# EAGLE design shaltregler (EAGLE 4.16)
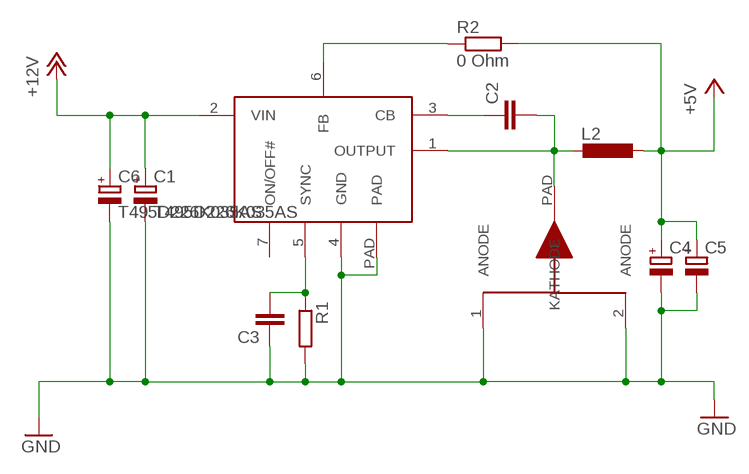
[diagram p0: schematic, sheet 1]

## Parts
C1  T495D226K035AS  CPOL-EUD/7343-31R  [D/7343-31R]
C2  C-EUC1206K  [C1206K]
C3  C-EUC1206K  [C1206K]
C4  CPOL-EUD/7343-31R  [D/7343-31R]
C5  CPOL-EUD/7343-31R  [D/7343-31R]
C6  T495D226K035AS  CPOL-EUD/7343-31R  [D/7343-31R]
D1  DIODE50WQ03FN  [TO-252]
IC1  LM2677S  [TO-263]
L2  DO3316P  [DO3316P]
R1  R-EU_R1206  [R1206]
R2  0 Ohm  R-EU_R1206  [R1206]

## Nets
+5V: C4.+ C5.+ L2.2 R2.2
+12V: C1.+ C6.+ IC1.2(VIN)
GND: C1.- C3.1 C4.- C5.- C6.- D1.1(ANODE) D1.2(ANODE) IC1.4(GND) IC1.PAD R1.2
N$1: IC1.6(FB) R2.1
N$2: C3.2 IC1.5(SYNC) R1.1
N$3: C2.2 D1.PAD(KATHODE) IC1.1(OUTPUT) L2.1
N$4: C2.1 IC1.3(CB)
Unconnected: IC1.7(ON/OFF#)

## Library data of the parts
C1 C4-C6 = rcl:CPOL-EU: POLARIZED CAPACITOR, European symbol
C2 C3 = rcl:C-EU: CAPACITOR, European symbol
D1 = Kochtec:DIODE
IC1 = Kochtec:LM2677: LM2677 National Semiconductor Simple Switcher High Efficiency 5A Step-Down Voltage Regulator with Sync
L2 = inductor-coilcraft:DO3316P: COILCRAFT
R1 R2 = rcl:R-EU_: RESISTOR, European symbol

## Board
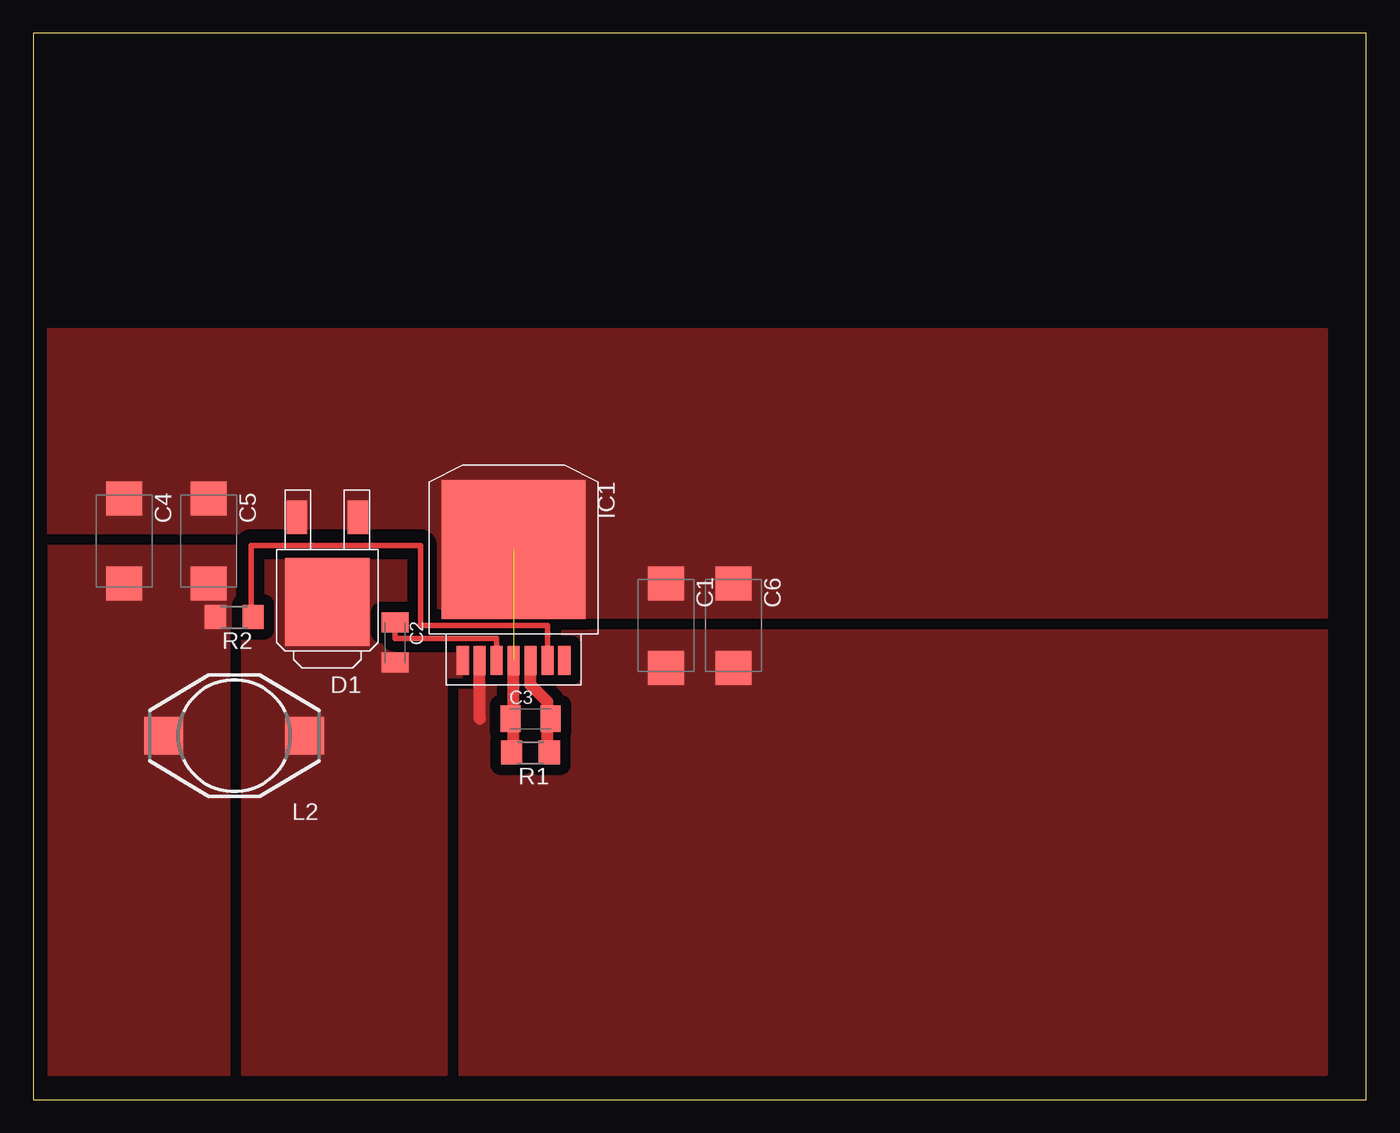
[diagram p1: board, top side]

Size 100 x 80 mm. Coordinates in mm from the lower left corner, seen from the top.
Outline: 0,0 100,0 100,80 0,80 0,0
Copper layers (1*16): Top 0.035mm / dielectric 1.5mm / Bottom 0.035mm
Design rules "default": minimum track width 10mil, minimum drill 24mil, track to track 8mil, track to pad 8mil, pad to pad 8mil, via to via 8mil, smd to smd 8mil, copper to edge 40mil, drill to drill 8mil, minimum pad ring 10mil, minimum via ring 8mil, stop-mask expansion 4mil, vias tented up to drill 0mil, thermal gap 10mil

### Footprints (pad centres in the part's own frame; a part is rotated, then mirrored left to right if it is on the bottom)
D/7343-31R = smd 2.55 x 2.7: + 3.175,0; - -3.175,0
C1206K = smd 1.5 x 2: 1 -1.5,0; 2 1.5,0
TO-252 = smd 1.524 x 2.54: 1 -2.286,-9.398; 2 2.286,-9.398 | smd 6.35 x 6.604: PAD 0,-3.048
TO-263 = smd 2.159 x 0.914: 1 8.331,-3.81; 2 8.331,-2.54; 3 8.331,-1.27; 4 8.331,0; 5 8.331,1.27; 6 8.331,2.54; 7 8.331,3.81 | smd 10.414 x 10.795: PAD 0,0
DO3316P = smd 2.92 x 2.79: 1 -5.28,0; 2 5.28,0
R1206 = smd 1.6 x 1.803: 1 -1.422,0; 2 1.422,0

### Placement (x,y rotation side)
C1  47.46,35.55 270 top
C2  27.14,34.29 270 top
C3  37.3,28.57 0 top
C4  6.82,41.91 270 top
C5  13.17,41.91 270 top
C6  52.54,35.55 270 top
D1  22.06,34.29 180 top
IC1  36.03,41.27 270 top
L2  15.08,27.3 180 top
R1  37.3,26.03 180 top
R2  15.08,36.19 180 top

### Tracks (layer width: path | path; a pad name or v marks a point on that pad's centre or on a via)
+5V
  pour Top (isolate 0.813, rank 3, no thermals): 1.1,41.91 1.1,1.9 15.08,1.9 15.08,41.91
+12V
  Top 0.889: 33.49,28.57 IC1.2
  pour Top (isolate 0.813, rank 3, no thermals): 96.99,35.55 96.99,1.9 30.95,1.9 30.95,35.55
GND  (1 unrouted)
  Top 0.889: 36.03,28.57 36.03,26.03 R1.2 | 36.03,28.57 IC1.4 | 36.03,28.57 C3.1
  pour Top (isolate 1.016, no thermals): 0.47,42.54 25.87,42.54 25.87,36.19 96.99,36.19 96.99,57.78 0.47,57.78
N$1
  Top 0.406: IC1.6 38.57,35.55 29.04,35.55 29.04,41.59 16.34,41.59 16.34,36.19 R2.1
N$2
  Top 0.889: IC1.5 37.3,31.11 38.57,29.84 38.57,28.57 | 38.57,28.57 38.57,26.03 R1.1 | 38.57,28.57 C3.2
N$3
  pour Top (isolate 0.813, rank 2, no thermals): 30.95,31.74 32.85,31.74 32.85,41.91 15.71,41.91 15.71,1.9 30.95,1.9
N$4
  Top 0.406: IC1.3 34.76,34.6 27.14,34.6 C2.1